# EAGLE design 6Ch_24Bit_FB_FeatherWing_RevB (EAGLE 9.4.2)
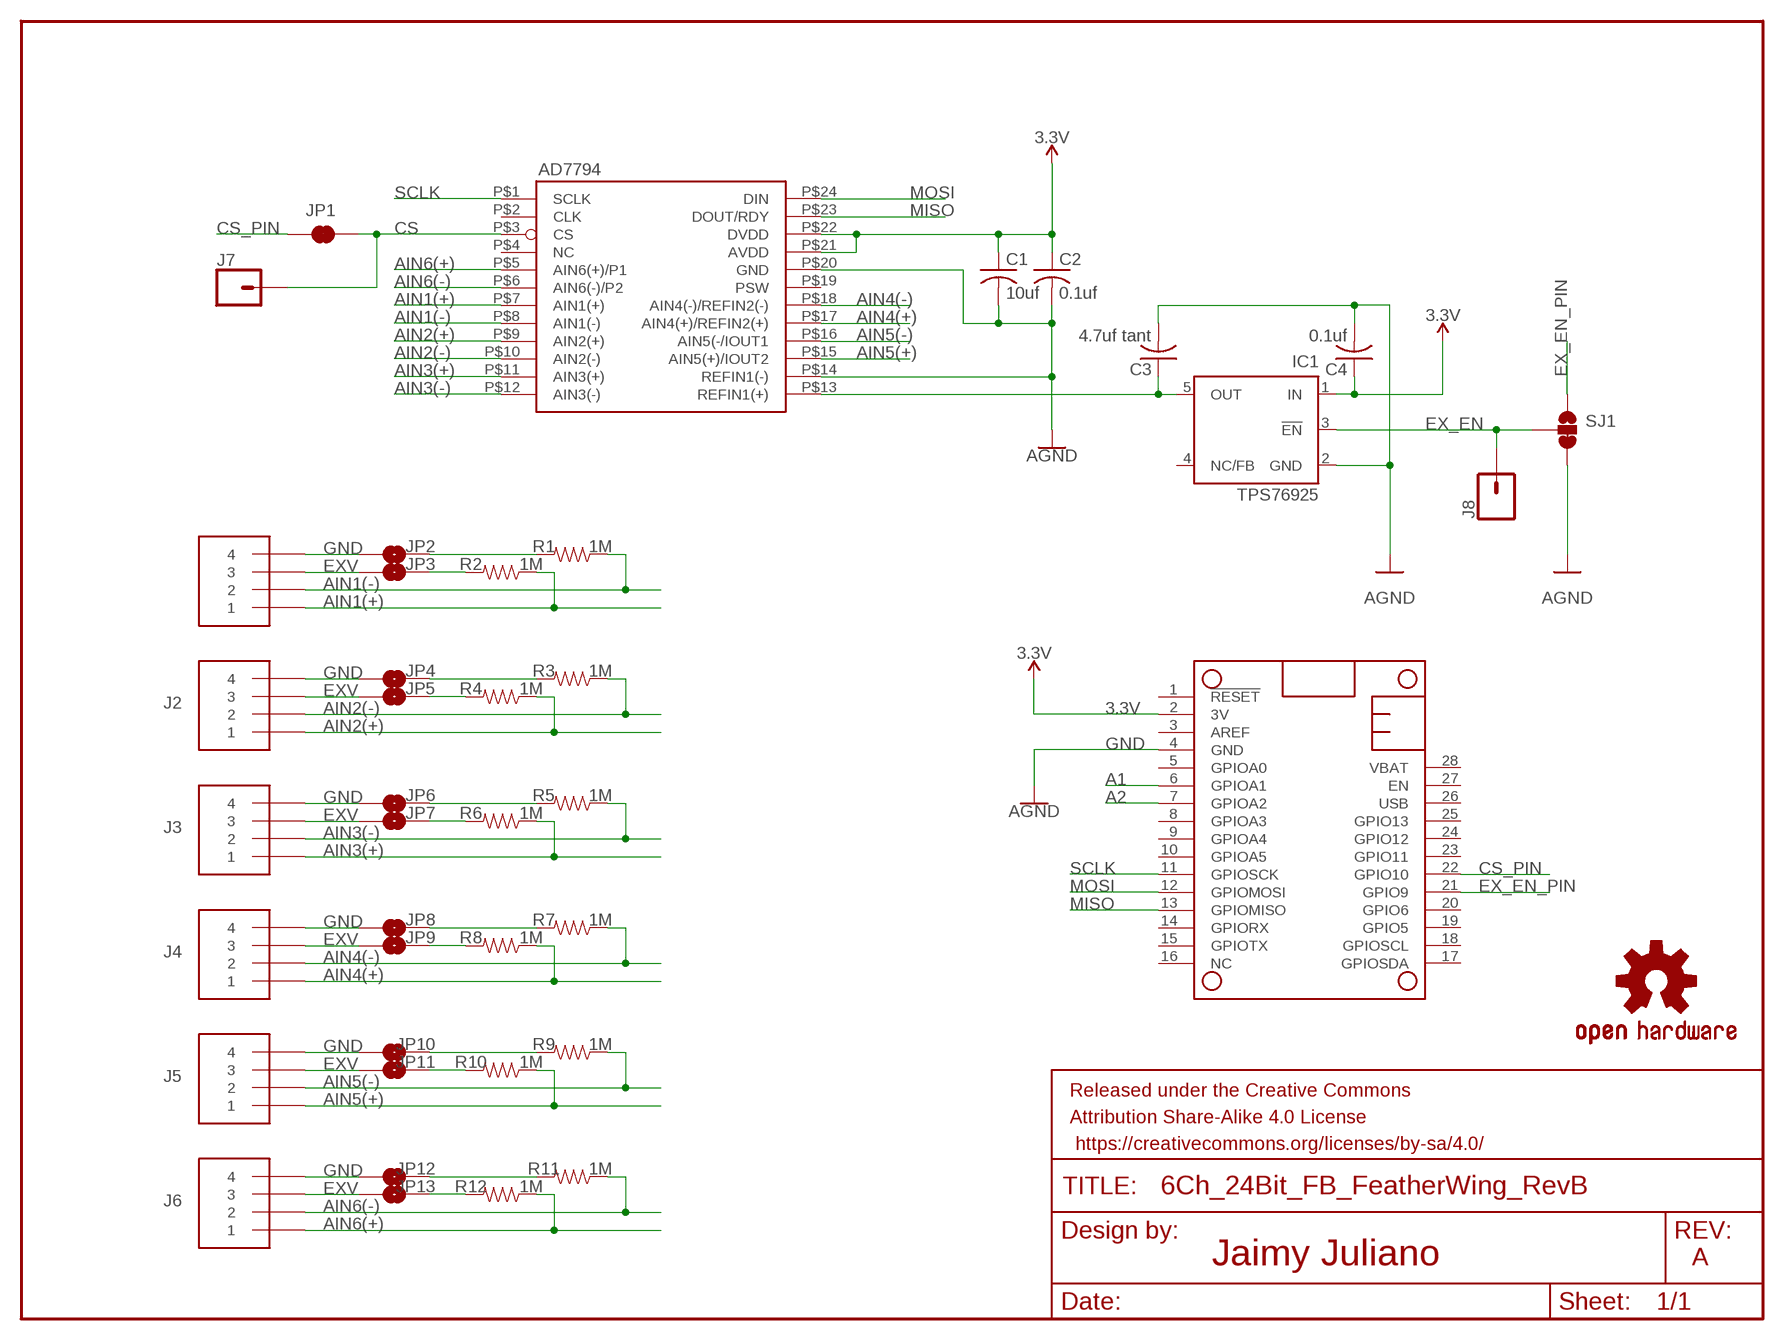
[diagram p0: schematic, sheet 1]

## Parts
C1  10uf  C-USC0603  [C0603]
C2  0.1uf  C-USC0603  [C0603]
C3  4.7uf tant  C-USC1206K  [C1206K]
C4  0.1uf  C-USC0603  [C0603]
FRAME2  FRAME-LETTER  [CREATIVE_COMMONS]
IC1  TPS76925  TPS77025  [SOT23-DBV]
J1  CON_PTSM_SOCKET-4-PTH-VERT  [CON_PTSM_SOCKET-4-PTH-VERT]
J2  CON_PTSM_SOCKET-4-PTH-VERT  [CON_PTSM_SOCKET-4-PTH-VERT]
J3  CON_PTSM_SOCKET-4-PTH-VERT  [CON_PTSM_SOCKET-4-PTH-VERT]
J4  CON_PTSM_SOCKET-4-PTH-VERT  [CON_PTSM_SOCKET-4-PTH-VERT]
J5  CON_PTSM_SOCKET-4-PTH-VERT  [CON_PTSM_SOCKET-4-PTH-VERT]
J6  CON_PTSM_SOCKET-4-PTH-VERT  [CON_PTSM_SOCKET-4-PTH-VERT]
J7  CONN_01PTH_NO_SILK_YES_STOP  [1X01_NO_SILK]
J8  CONN_01PTH_NO_SILK_YES_STOP  [1X01_NO_SILK]
JP1  JUMPER-SMT_2_NC_TRACE_NO-SILK  [SMT-JUMPER_2_NC_TRACE_NO-SILK]
JP2  JUMPER-SMT_2_NO_SILK  [SMT-JUMPER_2_NO_SILK]
JP3  JUMPER-SMT_2_NO_SILK  [SMT-JUMPER_2_NO_SILK]
JP4  JUMPER-SMT_2_NO_SILK  [SMT-JUMPER_2_NO_SILK]
JP5  JUMPER-SMT_2_NO_SILK  [SMT-JUMPER_2_NO_SILK]
JP6  JUMPER-SMT_2_NO_SILK  [SMT-JUMPER_2_NO_SILK]
JP7  JUMPER-SMT_2_NO_SILK  [SMT-JUMPER_2_NO_SILK]
JP8  JUMPER-SMT_2_NO_SILK  [SMT-JUMPER_2_NO_SILK]
JP9  JUMPER-SMT_2_NO_SILK  [SMT-JUMPER_2_NO_SILK]
JP10  JUMPER-SMT_2_NO_SILK  [SMT-JUMPER_2_NO_SILK]
JP11  JUMPER-SMT_2_NO_SILK  [SMT-JUMPER_2_NO_SILK]
JP12  JUMPER-SMT_2_NO_SILK  [SMT-JUMPER_2_NO_SILK]
JP13  JUMPER-SMT_2_NO_SILK  [SMT-JUMPER_2_NO_SILK]
LOGO1  OSHW-LOGOS  [OSHW-LOGO-S]
MS1  FEATHERWING_NODIM  [FEATHERWING_DIM]
R1  1M  1MOHM-0603-1/4W-5%  [0603]
R2  1M  1MOHM-0603-1/4W-5%  [0603]
R3  1M  1MOHM-0603-1/4W-5%  [0603]
R4  1M  1MOHM-0603-1/4W-5%  [0603]
R5  1M  1MOHM-0603-1/4W-5%  [0603]
R6  1M  1MOHM-0603-1/4W-5%  [0603]
R7  1M  1MOHM-0603-1/4W-5%  [0603]
R8  1M  1MOHM-0603-1/4W-5%  [0603]
R9  1M  1MOHM-0603-1/4W-5%  [0603]
R10  1M  1MOHM-0603-1/4W-5%  [0603]
R11  1M  1MOHM-0603-1/4W-5%  [0603]
R12  1M  1MOHM-0603-1/4W-5%  [0603]
SJ1  JUMPER-SMT_3_1-NC_TRACE_NO-SILK  [SMT-JUMPER_3_1-NC_TRACE_NO-SILK]
U1  AD7794  [TSSOP-24]

## Nets
3.3V: C1.1 C2.1 C4.1 IC1.1(IN) MS1.2(3V) U1.P$21(AVDD) U1.P$22(DVDD)
A1: MS1.6(GPIOA1)
A2: MS1.7(GPIOA2)
AIN1(+): J1.P$1 R2.1 U1.P$7(AIN1(+))
AIN1(-): J1.P$2 R1.1 U1.P$8(AIN1(-))
AIN2(+): J2.P$1 R4.1 U1.P$9(AIN2(+))
AIN2(-): J2.P$2 R3.1 U1.P$10(AIN2(-))
AIN3(+): J3.P$1 R6.1 U1.P$11(AIN3(+))
AIN3(-): J3.P$2 R5.1 U1.P$12(AIN3(-))
AIN4(+): J4.P$1 R8.1 U1.P$17(AIN4(+)/REFIN2(+))
AIN4(-): J4.P$2 R7.1 U1.P$18(AIN4(-)/REFIN2(-))
AIN5(+): J5.P$1 R10.1 U1.P$15(AIN5(+)/IOUT2)
AIN5(-): J5.P$2 R9.1 U1.P$16(AIN5(-/IOUT1)
AIN6(+): J6.P$1 R12.1 U1.P$5(AIN6(+)/P1)
AIN6(-): J6.P$2 R11.1 U1.P$6(AIN6(-)/P2)
CS: J7.1 JP1.2 U1.P$3(CS)
CS_PIN: JP1.1 MS1.22(GPIO10)
EX_EN: IC1.3(!EN) J8.1 SJ1.2
EX_EN_PIN: MS1.21(GPIO9) SJ1.1
EXV: C3.1 IC1.5(OUT) J1.P$3 J2.P$3 J3.P$3 J4.P$3 J5.P$3 J6.P$3 JP3.2 JP5.2 JP7.2 JP9.2 JP11.2 JP13.2 U1.P$13(REFIN1(+))
GND: C1.2 C2.2 C3.2 C4.2 IC1.2(GND) J1.P$4 J2.P$4 J3.P$4 J4.P$4 J5.P$4 J6.P$4 JP2.2 JP4.2 JP6.2 JP8.2 JP10.2 JP12.2 MS1.4(GND) SJ1.3 U1.P$14(REFIN1(-)) U1.P$20(GND) ; supply symbol labelled AGND
MISO: MS1.13(GPIOMISO) U1.P$23(DOUT/RDY)
MOSI: MS1.12(GPIOMOSI) U1.P$24(DIN)
N$1: JP3.1 R2.2
N$2: JP2.1 R1.2
N$3: JP5.1 R4.2
N$4: JP4.1 R3.2
N$5: JP7.1 R6.2
N$6: JP6.1 R5.2
N$7: JP9.1 R8.2
N$8: JP8.1 R7.2
N$9: JP11.1 R10.2
N$10: JP10.1 R9.2
N$11: JP13.1 R12.2
N$12: JP12.1 R11.2
SCLK: MS1.11(GPIOSCK) U1.P$1(SCLK)
Unconnected: IC1.4(NC/FB) MS1.1(!RESET) MS1.3(AREF) MS1.5(GPIOA0) MS1.8(GPIOA3) MS1.9(GPIOA4) MS1.10(GPIOA5) MS1.14(GPIORX) MS1.15(GPIOTX) MS1.16(NC) MS1.17(GPIOSDA) MS1.18(GPIOSCL) MS1.19(GPIO5) MS1.20(GPIO6) MS1.23(GPIO11) MS1.24(GPIO12) MS1.25(GPIO13) MS1.26(USB) MS1.27(EN) MS1.28(VBAT) U1.P$2(CLK) U1.P$4(NC) U1.P$19(PSW)

## Notes on the sheet
- Jaimy Juliano | A

## Library data of the parts
C1-C4 = rcl:C-US: CAPACITOR, American symbol; SPICEPREFIX: C
FRAME2 = SparkFun-Aesthetics:FRAME-LETTER: Schematic Frame - Letter Standard 8.5x11 US Letter frame
IC1 = texas:TPS770*: ULTRALOW-POWER 50-mA LOW-DROPOUT LINEAR REGULATORS 50-mA Low-Dropout Regulator Source: http://focus.ti.com/lit/ds/symlink/tps77001.pdf
J1-J6 = PikiTech:CON_PTSM_SOCKET-4-PTH-VERT
J7 J8 = SparkFun-Connectors:CONN_01: Single connection point. Often used as Generic Header-pin footprint for 0.1 inch spaced/style header connections On any of the 0.1 inch spaced packages, you can populate with these: Break Away Headers - Straight <https://www.sparkfun.com/products/116> (PRT-00116) Break Away Male Headers - Right Angle <https://www.sparkfun.com/products/553> (PRT-00553) Female Headers <https://www.sparkfun.com/products/115> (PRT-00115) Break Away Headers - Machine Pin <https://www.sparkfun.com/products/117> (PRT-00117) Break Away Female Headers - Swiss Machine Pin <https://www.sparkfun.com/products/743> (PRT-00743) This device is also useful as a general connection point to wire up your design to another part of your project. Our various solder wires solder well into these plated through hole pads. Hook-Up Wire - Assortment (Stranded, 22 AWG) <https://www.sparkfun.com/products/11375> (PRT-11375) Hook-Up Wire - Assortment (Solid Core, 22 AWG) <https://www.sparkfun.com/products/11367> (PRT-11367) View the entire wire category on our website here <https://www.sparkfun.com/categories/141> Special notes: SMTSO-256-ET is a "flush mount" nut for a 4-40 screw. We mostly use this on specialty testbeds; it is a nice way to connect hardware to your PCB at an adjustable hieght. Also note, the SNAP packages are for using a snappable style connector. We sell a baggie of snaps and they are also used on two LilyPad designs: Snap Assortment - 30 pack (male and female) <https://www.sparkfun.com/products/11347> (DEV-11347) LilyPad Arduino SimpleSnap <https://www.sparkfun.com/products/10941> (DEV-10941) LilyPad SimpleSnap Protoboard <https://www.sparkfun.com/products/10940> (DEV-10940)
JP1 = SparkFun-Jumpers:JUMPER-SMT_2_NC_TRACE: Normally closed trace jumper This jumper has a trace between two pads so it's normally closed (NC). Use a razor knife to open the connection. For best results follow the IPC guidelines for cutting traces: Cutout at least 0.063 mm (0.005 in). Remove all loose material to clean up the cut area. Seal the cut with an approved epoxy. Reapply solder to reclose the connection.
JP2-JP13 = SparkFun-Jumpers:JUMPER-SMT_2_NO: Normally open jumper This jumper has two pads in close proximity to each other. Apply solder to close the connection. Round pads are easier to solder for beginners, but are a lot larger. SparkFun Product that uses the round pads: SparkFun EL Sequencer <https://www.sparkfun.com/products/12781>
LOGO1 = SparkFun-Aesthetics:OSHW-LOGO: Open-Source Hardware (OSHW) Logo This logo indicates the piece of hardware it is found on incorporates a OSHW license and/or adheres to the definition of open source hardware found here: http://freedomdefined.org/OSHW
MS1 = adafruit:FEATHERWING
R1-R12 = SparkFun-Resistors:1MOHM: 1MΩ resistor A resistor is a passive two-terminal electrical component that implements electrical resistance as a circuit element. Resistors act to reduce current flow, and, at the same time, act to lower voltage levels within circuits. - Wikipedia; PROD_ID: RES-07868
SJ1 = SparkFun-Jumpers:JUMPER-SMT_3_1-NC_TRACE: Normally closed trace jumper (1 of 2 connections) This jumper has a trace between two pads so it's normally closed (NC). The other connection is normally open (NO). Use a razor knife to open the connection. For best results follow the IPC guidelines for cutting traces: Cutout at least 0.063 mm (0.005 in). Remove all loose material to clean up the cut area. Seal the cut with an approved epoxy. Reapply solder to reclose the connection, or to close the NO connection.
U1 = PikiTech:AD7794: 6ch 24bit s/d ADC

## Board
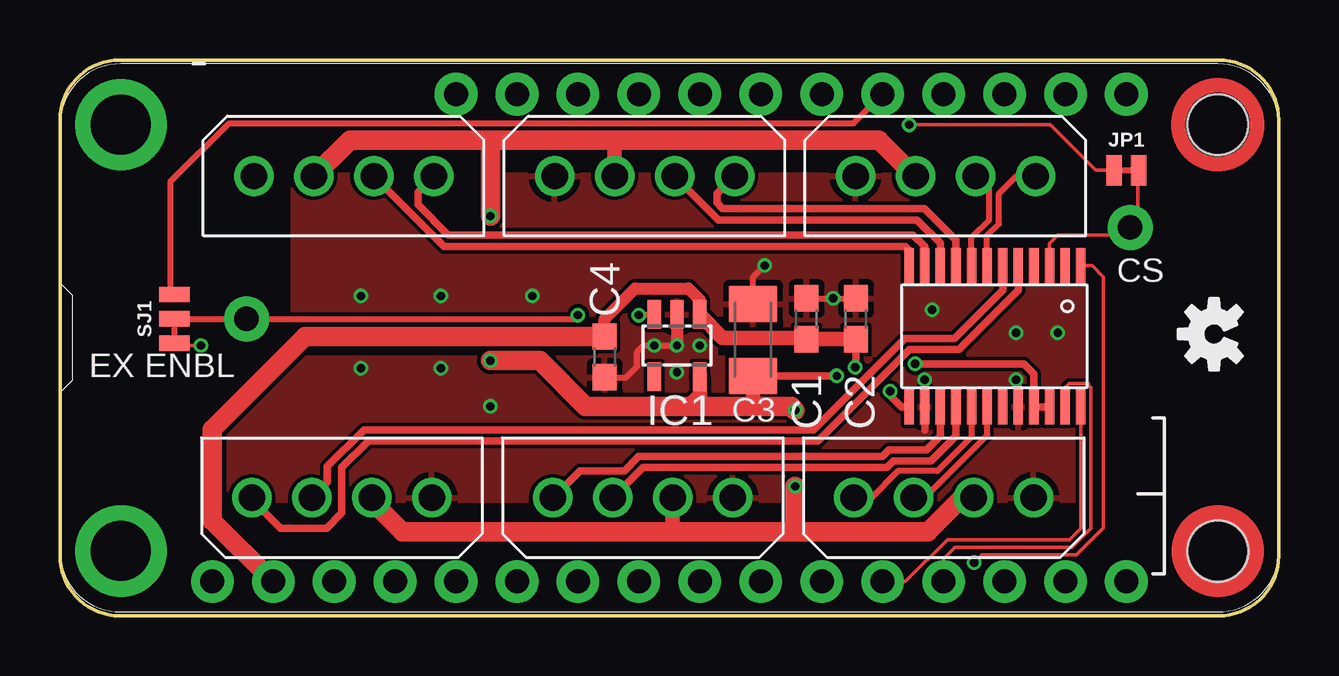
[diagram p1: board, top side]
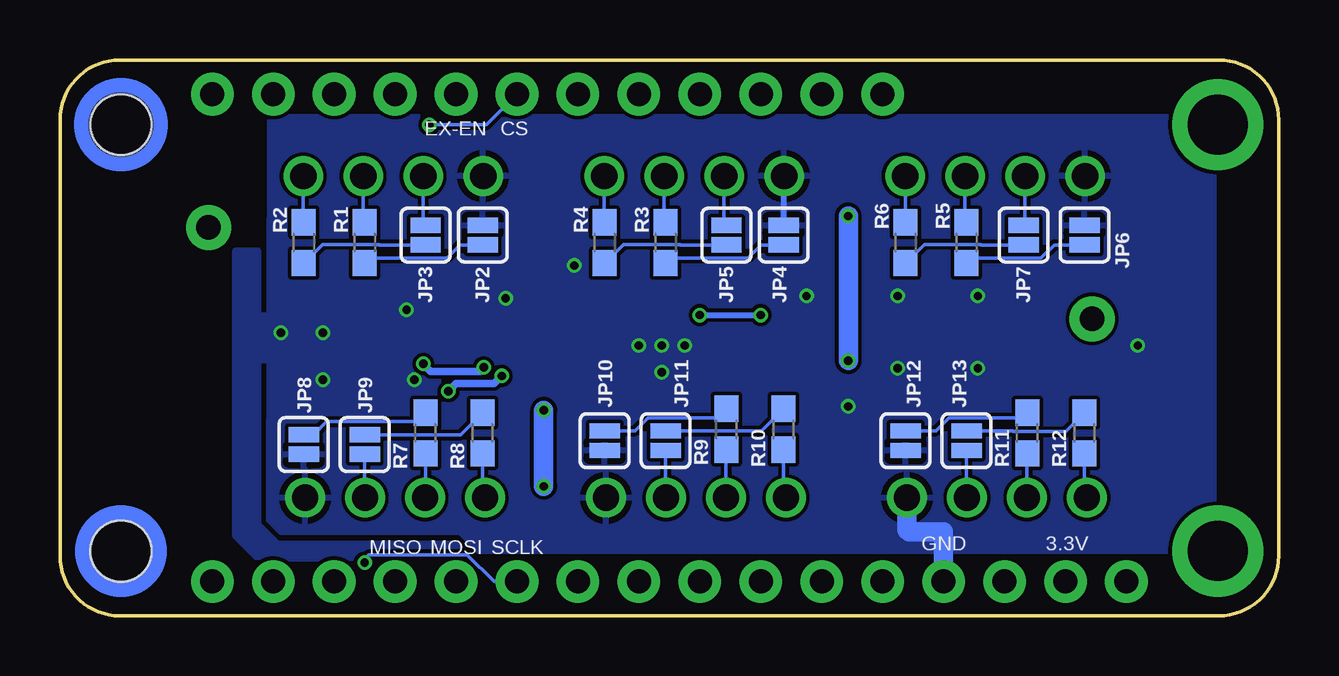
[diagram p2: board, bottom side, seen from below]

Size 50.8 x 23.18 mm. Coordinates in mm from the lower left corner, seen from the top.
Outline: 2.5,0 48.3,0 arc90 50.8,2.5 50.8,20.68 arc90 48.3,23.18 2.5,23.18 arc90 0,20.68 0,2.5 arc90 2.5,0
Copper layers (1*16): Top 0.035559375mm / dielectric 1.6mm / Bottom 0.035559375mm
Design rules "oshpark-2layer *": minimum track width 6mil, minimum drill 10mil, track to track 6mil, track to pad 6mil, pad to pad 6mil, via to via 6mil, smd to smd 6mil, copper to edge 15mil, drill to drill 6mil, minimum pad ring 5mil, minimum via ring 5mil, stop-mask expansion 2.5mil, vias tented up to drill 0mil, thermal gap 10mil

### Footprints (pad centres in the part's own frame; a part is rotated, then mirrored left to right if it is on the bottom)
C0603 = smd 1.1 x 1: 1 -0.85,0; 2 0.85,0
C1206K = smd 1.5 x 2: 1 -1.5,0; 2 1.5,0
SOT23-DBV = smd 0.55 x 1.2: 1 -0.95,-1.3; 2 0,-1.3; 3 0.95,-1.3; 4 0.95,1.3; 5 -0.95,1.3
CON_PTSM_SOCKET-4-PTH-VERT = drill 1.1: P$1 -3.75,0; P$2 -1.25,0; P$3 1.25,0; P$4 3.75,0
1X01_NO_SILK = drill 1.016 pad 1.88: 1 0,0
SMT-JUMPER_2_NC_TRACE_NO-SILK = smd 0.635 x 1.27: 1 -0.508,0; 2 0.508,0
SMT-JUMPER_2_NO_SILK = smd 0.635 x 1.27: 1 -0.406,0; 2 0.406,0
FEATHERWING_DIM = drill 1 pad 1.778: 1 6.35,1.27; 2 8.89,1.27; 3 11.43,1.27; 4 13.97,1.27; 5 16.51,1.27; 6 19.05,1.27; 7 21.59,1.27; 8 24.13,1.27; 9 26.67,1.27; 10 29.21,1.27; 11 31.75,1.27; 12 34.29,1.27; 13 36.83,1.27; 14 39.37,1.27; 15 41.91,1.27; 16 44.45,1.27; 17 44.45,21.59; 18 41.91,21.59; 19 39.37,21.59; 20 36.83,21.59; 21 34.29,21.59; 22 31.75,21.59; 23 29.21,21.59; 24 26.67,21.59; 25 24.13,21.59; 26 21.59,21.59; 27 19.05,21.59; 28 16.51,21.59 | drill 2.5 pad 3.81: P$1 2.54,20.32; P$2 2.54,2.54 | hole 2.54: 48.26,20.32; 48.26,2.54
0603 = smd 1.1 x 1: 1 -0.85,0; 2 0.85,0
SMT-JUMPER_3_1-NC_TRACE_NO-SILK = smd 0.635 x 1.27: 1 -1.016,0; 2 0,0; 3 1.016,0
TSSOP-24 = smd 1.45 x 0.4: P$1 0,0; P$2 0,-0.65; P$3 0,-1.3; P$4 0,-1.95; P$5 0,-2.6; P$6 0,-3.25; P$7 0,-3.9; P$8 0,-4.55; P$9 0,-5.2; P$10 0,-5.85; P$11 0,-6.5; P$12 0,-7.15; P$13 5.9,-7.15; P$14 5.9,-6.5; P$15 5.9,-5.85; P$16 5.9,-5.2; P$17 5.9,-4.55; P$18 5.9,-3.9; P$19 5.9,-3.25; P$20 5.9,-2.6; P$21 5.9,-1.95; P$22 5.9,-1.3; P$23 5.9,-0.65; P$24 5.9,0

### Placement (x,y rotation side)
C1  31.11,12.38 90 top
C2  33.18,12.38 90 top
C3  28.89,11.51 90 top
C4  22.7,10.79 270 top
FRAME2  3.02,-11.43 0 top  (outside the outline)
IC1  25.72,11.27 180 top
J1  36.91,18.34 180 top
J2  24.37,18.34 180 top
J3  11.83,18.34 180 top
J4  36.83,4.92 0 top
J5  24.29,4.92 0 top
J6  11.75,4.92 0 top
J7  44.61,16.19 0 top
J8  7.78,12.38 0 top
JP1  44.45,18.57 0 top
JP2  33.18,15.88 90 bottom
JP3  35.56,15.88 90 bottom
JP4  20.64,15.88 90 bottom
JP5  23.02,15.88 90 bottom
JP6  8.1,15.88 90 bottom
JP7  10.64,15.88 90 bottom
JP8  40.64,7.14 270 bottom
JP9  38.1,7.14 270 bottom
JP10  28.1,7.3 270 bottom
JP11  25.56,7.3 270 bottom
JP12  15.56,7.3 270 bottom
JP13  13.02,7.3 270 bottom
LOGO1  48.1,11.75 90 top
MS1  0,0.16 0 top
R1  38.1,15.56 270 bottom
R2  40.64,15.56 270 bottom
R3  25.56,15.56 270 bottom
R4  28.1,15.56 270 bottom
R5  13.02,15.56 270 bottom
R6  15.56,15.56 270 bottom
R7  35.56,7.62 90 bottom
R8  33.18,7.62 90 bottom
R9  23.02,7.78 90 bottom
R10  20.64,7.78 90 bottom
R11  10.48,7.62 90 bottom
R12  8.1,7.62 90 bottom
SJ1  4.76,12.38 270 top
U1  42.55,14.6 270 top

### Tracks (layer width: path | path; a pad name or v marks a point on that pad's centre or on a via)
3.3V  (via drill 0.35)
  Top 0.305: U1.P$22 U1.P$21 40.59,10.08 40.18,10.5 35.66,10.5 v35.65,10.51 | C2.1 33.18,10.39 v33.14,10.36
  Top 0.508: 26.67,12.54 IC1.1 26.67,13.17 26.67,13.18 26.19,13.65 23.97,13.65 22.7,12.38 C4.1 | 31.06,11.59 C1.1
  Top 0.61: 26.67,12.54 27.62,11.59 31.06,11.59 | C1.1 C2.1
  Top 0.813: C4.1 10.22,11.64 6.35,7.78 6.35,3.97 MS1.2
  Bottom 0.305: v35.65,10.51 35.34,10.2 33.3,10.2 v33.14,10.36
AIN1(+)
  Top 0.254: U1.P$7 38.65,15.85 39.14,16.34 39.14,17.61 39.87,18.34 J1.P$1
  Bottom 0.152: J1.P$1 40.66,16.43 R2.1
AIN1(-)
  Top 0.254: U1.P$8 37.99,15.77 38.73,16.51 38.73,17.76 J1.P$2
  Bottom 0.152: J1.P$2 38.16,16.47 R1.1
AIN2(+)
  Top 0.305: U1.P$9 37.34,15.68 36.04,16.99 27.61,16.99 27.38,17.22 27.38,17.6 J2.P$1
  Bottom 0.152: J2.P$1 28.12,16.43 R4.1
AIN2(-)
  Top 0.305: U1.P$10 36.7,15.53 35.72,16.51 27.44,16.51 J2.P$2
  Bottom 0.152: J2.P$2 25.62,16.47 R3.1
AIN3(+)
  Top 0.305: U1.P$11 36.05,15.39 35.56,15.87 16.18,15.87 14.92,17.14 14.92,17.68 J3.P$1
  Bottom 0.152: R6.1 15.56,18.32 J3.P$1
AIN3(-)
  Top 0.305: U1.P$12 35.4,15.25 35.24,15.4 16.01,15.4 J3.P$2
  Bottom 0.152: J3.P$2 13.08,16.47 R5.1
AIN4(+)
  Top 0.254: U1.P$17 37.99,7.45 36.57,6.03 34.92,6.03 33.81,4.92 J4.P$1
  Bottom 0.152: R8.1 33.18,5.02 J4.P$1
AIN4(-)
  Top 0.254: U1.P$18 38.65,7.53 36.04,4.92 J4.P$2
  Bottom 0.152: R7.1 35.56,4.94 J4.P$2
AIN5(+)
  Top 0.305: J5.P$1 21.67,6.05 23.52,6.05 24.12,6.65 34.28,6.65 34.56,6.92 36.12,6.92 36.7,7.5 U1.P$15
  Bottom 0.152: R10.1 20.64,5.02 J5.P$1
AIN5(-)
  Top 0.305: U1.P$16 37.34,7.5 36.31,6.46 34.75,6.46 34.47,6.19 24.31,6.19 J5.P$2
  Bottom 0.152: R9.1 23.04,6.91 J5.P$2
AIN6(+)
  Top 0.254: 8,4.86 J6.P$1
  Top 0.305: U1.P$5 39.95,13.59 37.47,11.11 35.4,11.11 31.59,7.3 12.86,7.3 11.75,6.19 11.75,4.29 11.11,3.65 9.21,3.65 8,4.86
  Bottom 0.152: R12.1 8.1,5.02 J6.P$1
AIN6(-)
  Top 0.305: U1.P$6 39.3,13.59 37.28,11.57 35.21,11.57 31.4,7.76 12.67,7.76 11.14,6.23 11.14,5.56 J6.P$2
  Bottom 0.152: R11.1 10.5,6.75 J6.P$2
CS
  Top 0.152: U1.P$3 41.24,15.53 41.59,15.87 44.29,15.87 J7.1 44.93,16.51 44.93,18.54 JP1.2
CS_PIN  (via drill 0.35)
  Top 0.152: v35.4,20.48 41.27,20.48 43.18,18.57 JP1.1
  Bottom 0.152: MS1.22 33.02,20.48 v35.4,20.48
EX_EN  (via drill 0.35)
  Top 0.152: IC1.3 24.74,12.54
  Top 0.203: 21.43,12.38 v21.59,12.54
  Top 0.254: 24.74,12.54 v24.13,12.54 | 21.43,12.38 J8.1 SJ1.2
  Bottom 0.254: v24.13,12.54 v21.59,12.54
EX_EN_PIN
  Top 0.254: MS1.21 33.08,20.54 7.04,20.54 4.6,18.1 4.6,13.56 SJ1.1
EXV  (via drill 0.35)
  Top 0.305: C3.1 32.38,10.01 v32.38,10 | v34.61,9.37 34.61,9.17 35.08,8.7 U1.P$13
  Top 0.508: J4.P$3 37.6,4.92 | 13,4.78 J6.P$3 | 25.54,3.51 25.56,3.49 | 35.64,18.34 J1.P$3 | 23.12,19.63 23.34,19.84
  Top 0.61: J5.P$3 25.54,3.51 | J2.P$3 23.12,19.63 | IC1.5 26.67,9.2 26.19,8.73 | C3.1 28.89,8.89 28.73,8.73
  Top 0.813: 37.6,4.92 36.17,3.49 30.64,3.49 | 30.64,3.49 25.56,3.49 14.29,3.49 13,4.78 | J3.P$3 12.09,19.84 17.94,19.84 | 17.94,19.84 23.34,19.84 34.13,19.84 35.64,18.34 | v17.94,16.67 17.94,19.84 | 30.64,3.49 v30.64,5.4 | v17.94,10.64 20,10.64 21.91,8.73 26.19,8.73 28.73,8.73 30.48,8.73 v30.64,8.57
  Bottom 0.152: J1.P$3 35.66,16.38 JP3.2 | J2.P$3 23.12,16.38 JP5.2 | J3.P$3 10.58,16.34 JP7.2 | JP9.2 38.1,4.94 J4.P$3 | JP11.2 25.56,4.94 J5.P$3 | JP13.2 13.02,4.94
  Bottom 0.305: v34.61,9.37 34.29,9.68 32.7,9.68 v32.38,10
  Bottom 0.61: 13.02,4.94 J6.P$3
  Bottom 0.813: v17.94,10.64 v17.94,16.67 | v30.64,5.4 v30.64,8.57
GND  (via drill 0.35)
  Top 0.152: v5.87,11.27 4.86,11.27 SJ1.3
  Top 0.254: C4.2 23.6,9.94 24.05,10.4 24.05,11 24.32,11.27 v25.72,11.27 | C1.2 v32.23,13.23 C2.2 | C3.2 28.89,14.12 29.37,14.6 v29.37,14.6 | v39.85,9.84 39.95,9.74 U1.P$20
  Top 0.305: U1.P$14 36.05,7.74
  Top 0.508: IC1.2 v25.72,11.27
  Bottom 0.254: J2.P$4 20.64,18.32 JP4.2
  Bottom 0.813: MS1.4 13.97,3.49 15.4,3.49 15.5,3.59 J6.P$4
  other vias: 24.77,11.27 25.72,10.16 36.35,12.76 39.85,11.8 41.59,11.8 12.54,13.33 15.88,13.33 15.88,10.32 12.54,10.32 17.94,8.73 19.68,13.33 26.67,11.27 36.04,9.84
  pour Bottom: 2.7,20.8 42.07,20.8 42.1,4.02 41.59,3.49 34.13,3.49 33.33,2.7 2.7,2.7
  pour Top: 22.54,13.33 27.3,13.33 27.3,9.37 22.54,9.37
  pour Top: 27.94,14.92 42.7,14.92 42.7,8.1 27.94,8.1
  pour Top: 9.68,18.42 43.18,18.42 43.18,12.54 9.68,12.54
  pour Top: 10.16,10.79 43.97,10.79 43.97,4.76 6.99,4.76 6.99,7.62
  pour Bottom (rank 3): 41.12,12.54 41.12,10.64 42.55,10.64 42.55,3.81 41.75,3.02 34.29,3.02 33.66,2.38 42.55,2.38 43.5,3.33 43.5,15.24 42.55,15.24 42.55,12.54
MISO
  Top 0.152: MS1.13 36.83,2.38 37.31,2.86 42.18,2.86 42.97,3.65 42.97,9.52 42.86,9.64 42.86,9.68 42.07,9.68 41.9,9.51 U1.P$23
MOSI
  Top 0.152: MS1.12 35.24,1.43 36.99,3.17 42.07,3.17 42.55,3.65 U1.P$24
N$1
  Bottom 0.152: JP3.1 37.49,15.47 37.51,15.49 39.86,15.49 R2.2
N$2
  Bottom 0.152: JP2.1 34.12,15.47 34.67,14.92 37.88,14.92 R1.2
N$3
  Bottom 0.152: JP5.1 24.95,15.47 24.96,15.49 27.32,15.49 R4.2
N$4
  Bottom 0.152: JP4.1 21.58,15.47 22.13,14.92 25.34,14.92 R3.2
N$5
  Bottom 0.152: JP7.1 12.4,15.47 12.42,15.49 14.78,15.49 R6.2
N$6
  Bottom 0.152: JP6.1 9.36,15.47 9.91,14.92 12.8,14.92 R5.2
N$7
  Bottom 0.152: JP9.1 34.1,7.55 R8.2
N$8
  Bottom 0.152: JP8.1 40.23,7.55 39.69,8.1 35.93,8.1 R7.2
N$9
  Bottom 0.152: JP11.1 21.56,7.71 R10.2
N$10
  Bottom 0.152: JP10.1 26.84,7.71 26.29,8.25 23.39,8.25 R9.2
N$11
  Bottom 0.152: JP13.1 11.09,7.71 11.07,7.69 8.88,7.69 R12.2
N$12
  Bottom 0.152: JP12.1 14.29,7.71 13.75,8.25 10.69,8.25 R11.2
SCLK  (via drill 0.35)
  Top 0.152: v38.1,2.22 38.42,2.55 42.37,2.55 43.5,3.67 43.5,14.13 43.02,14.6 U1.P$1
  Bottom 0.152: MS1.11 32.71,1.43 33.83,2.55 37.29,2.55 37.3,2.54 37.94,2.54 38.1,2.38 v38.1,2.22
(copper drawn outside any net)
  shapes: Bottom circle x2, Top circle x2

### Text on the board
tPlace: CS | EX ENBL
bNames: CS | EX-EN | 3.3V | GND | SCLK | MOSI | MISO
Document: Jaimy Juliano